# EasyEDA Pro project ProPrj_Gorb_热插拔无线鼠标V1.epro, schematic Schematic
Board Name: Gorb_V1; Create Date: 2025-12-01; Page Name: P1; Project Name: gorb; Schematic Name: Schematic; Update Date: 2025-12-15; Company: EasyEDA.com; Page Size: A4; Version: V1.0
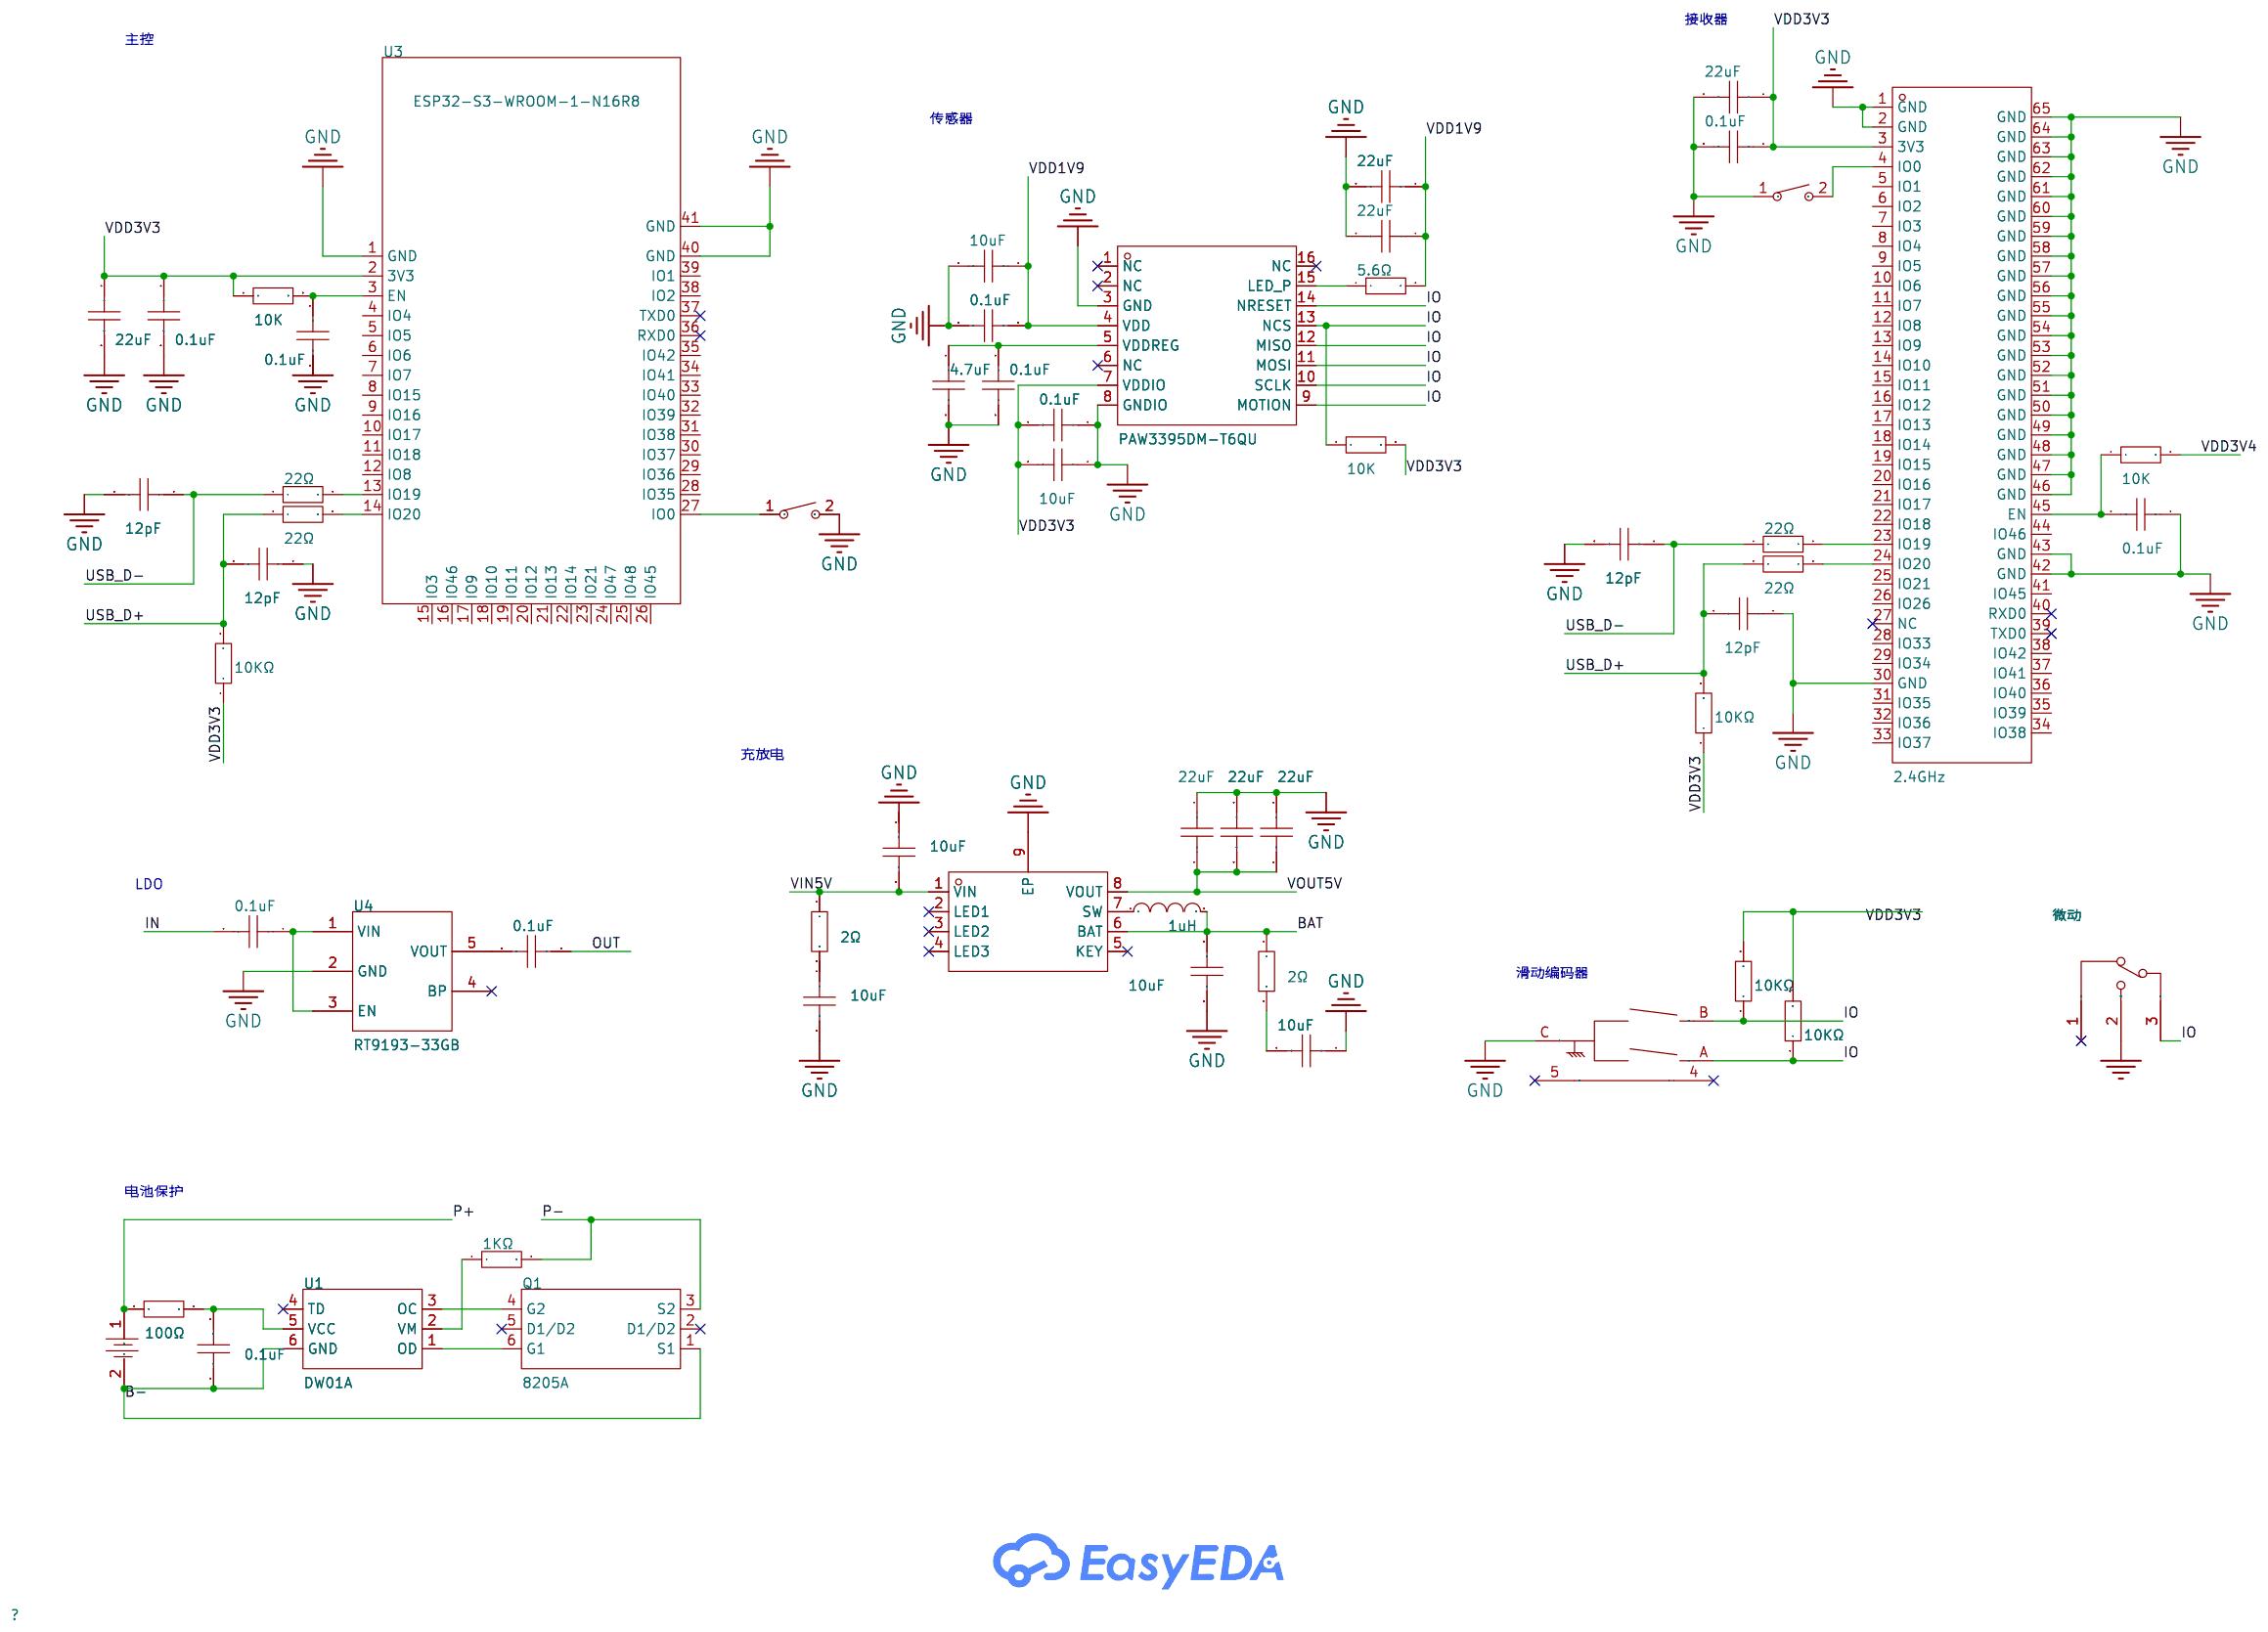
[diagram p0: schematic sheet]

## Parts
C1  0.1uF  [C0603]
C2  22uF  [C0603]
C3  0.1uF  [C0603]
C4  0.1uF  [C0603]
C5  12pF  [C0603]
C6  12pF  [C0603]
C7  0.1uF  [C0603]
C8  0.1uF  [C0603]
C9  10uF  [C0603]
C10  10uF  [C0603]
C11  10uF  [C0603]
C13  10uF  [C0603]
C14  22uF  [C0603]
C15  22uF  [C0603]
C16  22uF  [C0603]
C17  0.1uF  [C0603]
C19  10uF  [C0603]
C20  0.1uF  [C0603]
C21  4.7uF  [C0603]
C22  0.1uF  [C0603]
C23  10uF  [C0603]
C24  22uF  [C0603]
C25  22uF  [C0603]
C26  0.1uF  [C0603]
C27  22uF  [C0603]
C28  0.1uF  [C0603]
C29  12pF  [C0603]
C30  12pF  [C0603]
L1  1uH  [L0603]
Q1  8205A  [SOT-23-6_L2.9-W1.6-P0.95-LS2.8-BR]
R1  100Ω  [R0603]
R2  1KΩ  [R0603]
R3  10K  [R0603]
R4  22Ω  [R0603]
R5  22Ω  [R0603]
R6  10KΩ  [R0603]
R7  10KΩ  [R0603]
R8  2Ω  [R0603]
R9  2Ω  [R0603]
R10  5.6Ω  [R0603]
R11  10K  [R0603]
R12  10K  [R0603]
R13  22Ω  [R0603]
R14  22Ω  [R0603]
R?#1  10KΩ  [R0603]
SW1  CMI627301D07  [SW-TH_L6.2-W6.2-P5.00]
SW2  EC10E1220501  [SW-TH_EC10EXXXXXXX]
SW3  CMI627301D07  [SW-TH_L6.2-W6.2-P5.00]
U1  DW01A  [SOT-23-6_L2.9-W1.6-P0.95-LS2.8-BL]
U2  7号电池盒  [BAT-TH_L51.0-W24.0-P13.50-D0.8]
U3  ESP32-S3-WROOM-1-N16R8  [WIRELM-SMD_ESP32-S3-WROOM-1]
U4  RT9193-33GB  [SOT-23-5_L3.0-W1.7-P0.95-LS2.8-BL]
U5  2.4GHz  [WIFI-SMD_ESP32-MINI-1-N4]
U6  IP5306  [ESOP-8_L4.9-W3.9-P1.27-LS6.0-BL-EP]
U7  PAW3395DM-T6QU  [DIP-16_PAW3395DM-T6QU]
U8  10KΩ  [R0603]
微动  K9-1267T  [SW-TH_K9-1267T]

## Library data of the parts
C1-C11 C13-C17 C19-C30 = CAP_0603: Supplier Footprint: 0603
L1 = L_0603
Q1 = 8205A_C5370944: Number:2 N-Channel Drain to Source Voltage:20V Current - Continuous Drain(Id):6A RDS(on):25mΩ@2.5V,3A Pd - Power Dissipation:1.5W Gate Threshold Voltage (Vgs(th)):500mV Gate Charge(Qg):- Input Capacitance(Ciss):466pF@10V Reverse Transfer Capacitance (Crss; LCSC Part Name: 2个N沟道 耐压:20V 电流:6A; Supplier Part: C5370944; Manufacturer: TECH PUBLIC(台舟); Supplier Footprint: SOT-23-6; JLCPCB Part Class: Extended Part; Datasheet: https://item.szlcsc.com/datasheet/8205A/6217981.html; Supplier: LCSC; Number: 2 N-Channel; Drain to Source Voltage: 20V; Current - Continuous Drain(Id): 6A; RDS(on): 25mΩ@2.5V,3A; Pd - Power Dissipation: 1.5W; Gate Threshold Voltage (Vgs(th)): 500mV; Input Capacitance(Ciss): 466pF@10V; Reverse Transfer Capacitance (Crss@Vds): 58pF@10V; Operating Temperature: -55℃~+150℃
R1-R14 R?#1 U8 = Res_0603: Supplier Footprint: 0603
SW1 SW3 = CMI627301D07: Circuit:SPST Actuator Style:Round Button Operating Force:70gf Mounting Style:Direct Insert Switch Length:6.2mm Switch Width:6.2mm Switch Height:7.3mm Strike Gundam:Without Contact Current:50mA Voltage Rating (AC):- Voltage Rating (DC):12V Insulation Resis; LCSC Part Name: 6.2*6.2*7.3mm 直插 轻触开关; Supplier Part: C400268; Manufacturer: Kailh(凯华); Supplier Footprint: 插件; JLCPCB Part Class: Extended Part; Datasheet: https://atta.szlcsc.com/upload/public/pdf/source/20190626/C400268_F7CB2279ABA3B564A1652B4FF668916E.pdf; Supplier: LCSC; Circuit: SPST; Actuator Style: Round Button; Operating Force: 70gf; Mounting Style: Direct Insert; Switch Length: 6.2mm; Switch Width: 6.2mm; Switch Height: 7.3mm; Strike Gundam: Without; Contact Current: 50mA; Voltage Rating (DC): 12V; Insulation Resistance: 100MΩ; Actuator/Cap Color: Red; Pin Style: PCPin; Mechanical Life: 3 million times
SW2 = EC10E1220501: Supplier Part: C160889; Manufacturer: ALPSALPINE(阿尔卑斯阿尔派); Supplier Footprint: 插件; JLCPCB Part Class: Extended Part; Datasheet: https://atta.szlcsc.com/upload/public/pdf/source/20180227/C160889_15197014267581370273.pdf; Supplier: LCSC
U1 = DW01A_C351410: Supplier Part: C351410; Manufacturer: PUOLOP(迪浦); Supplier Footprint: SOT-23-6L; JLCPCB Part Class: Extended Part; Datasheet: https://atta.szlcsc.com/upload/public/pdf/source/20190109/C351410_3E9B9491D1909DF24C48D1B9CD871392.pdf; Supplier: LCSC
U2 = 7号电池盒: Supplier Part: C9900015507; Supplier Footprint: 引脚间距：13.5mm ,直插，2pin; JLCPCB Part Class: Extended Part; Supplier: LCSC
U3 = ESP32-S3-WROOM-1-N16R8: LCSC Part Name: 通用型Wi-Fi+低功耗蓝牙MCU模组; Supplier Part: C2913202; Manufacturer: ESPRESSIF(乐鑫); Supplier Footprint: SMD,25.5x18mm; JLCPCB Part Class: Extended Part; Datasheet: https://item.szlcsc.com/datasheet/ESP32-S3-WROOM-1-N16R8/3198300.html; Supplier: LCSC
U4 = RT9193-33GB: Output Type:Fixed Voltage - Supply:5.5V Output Voltage:3.3V Output Voltage:3.3V Output Current:300mA Power Supply Rejection Ratio (PSRR):-50dB@(10kHz) Voltage Dropout:220mV@(300mA) standby current:90uA Noise:100uVrms Features:Over Current Protection；Enabl; LCSC Part Name: 输入5.5V 输出3.3V 300mA; Supplier Part: C15651; Manufacturer: RICHTEK(立锜); Supplier Footprint: SOT-23-5; JLCPCB Part Class: Extended Part; Datasheet: https://item.szlcsc.com/datasheet/RT9193-33GB/16332.html; Supplier: LCSC; Output Type: Fixed; Voltage - Supply: 5.5V; Output Voltage: 3.3V; Output Current: 300mA; Power Supply Rejection Ratio (PSRR): -50dB@(10kHz); Voltage Dropout: 220mV@(300mA); standby current: 90uA; Noise: 100uVrms; Features: Over Current Protection；Enable；Over Temperature Protection; Operating Temperature: -40℃~+125℃@(Tj); Output Configuration: Positive; Number of Outputs: 1
U5 = ESP32-S2-MINI-1-N4: Core Processor:ESP32-S2FH4 chip Support Interface:I2C；GPIO；SPI；PWM；ADC；UART；USB；I2S Frequency:2.4GHz Output Power:19.5dBm Output Power:19.5dBm; LCSC Part Name: ESP32-S2-MINI-1-N4 停产; Supplier Part: C2847294; Manufacturer: ESPRESSIF(乐鑫); Supplier Footprint: SMD-65P; JLCPCB Part Class: Extended Part; Datasheet: https://atta.szlcsc.com/upload/public/pdf/source/20241030/68691157046C7706EC66C3038C2D4369.pdf; Supplier: LCSC; Core Processor: ESP32-S2FH4 chip; Support Interface: I2C；GPIO；SPI；PWM；ADC；UART；USB；I2S; Output Power: 19.5dBm
U6 = IP5306: The Chip Type:Charging IC；Protection IC Voltage - Supply:4.65V~5.5V Voltage - Supply:4.65V~5.5V Charge Current - Max:2.1A Charging Saturation Voltage:4.2V End-Off Voltage:3V Type of Battery:Lithium Battery Number of Cells:1 Number of Cells:1 Operating Tem; LCSC Part Name: 集成2.1A充电器和2.1A放电器的全集成移动电源系统级芯片; Supplier Part: C181692; Manufacturer: INJOINIC(英集芯); Supplier Footprint: ESOP-8; JLCPCB Part Class: Extended Part; Datasheet: https://item.szlcsc.com/datasheet/IP5306/193089.html; Supplier: LCSC; The Chip Type: Charging IC；Protection IC; Voltage - Supply: 4.65V~5.5V; Charge Current - Max: 2.1A; Charging Saturation Voltage: 4.2V; End-Off Voltage: 3V; Type of Battery: Lithium Battery; Number of Cells: 1; Operating Temperature: 0℃~+70℃; Supply Current (Iq): 100uA; Interface: I2C
U7 = PAW3395DM-T6QU: Supplier Part: C9900026543; Supplier Footprint: 16-PDIP; JLCPCB Part Class: Extended Part; Supplier: LCSC
微动 = K9-1267T: Circuit:SPDT Length:12.7mm Width:5.7mm Switch Height:7.5mm Current Rating (DC):100mA Voltage Rating (DC):30V Current Rating (AC):- Voltage Rating (AC):- Life:3,000,000 Cycles Operating Temperature:-25℃~+85℃ Operating Temperature:-25℃~+85℃; LCSC Part Name: 12.7*5.7*7.5mm 插件微动开关; Supplier Part: C107266; Manufacturer: 韩国韩荣; Supplier Footprint: 插件,12.7x5.7mm; JLCPCB Part Class: Extended Part; Datasheet: https://item.szlcsc.com/datasheet/K9-1267T/108484.html; Supplier: LCSC; Circuit: SPDT; Length: 12.7mm; Width: 5.7mm; Switch Height: 7.5mm; Current Rating (DC): 100mA; Voltage Rating (DC): 30V; Life: 3,000,000 Cycles; Operating Temperature: -25℃~+85℃

## Nets
GND: C2.2 C3.2 C4.2 C5.1 C6.2 C9.2 C10.1 C11.1 C13.2 C14.1 C15.1 C16.1 C17.2 C19.2 C20.2 C21.2 C22.1 C23.1 C24.2 C25.2 C26.2 C27.2 C28.1 C29.1 C30.2 SW1.2 SW2.C SW3.1 U3.1(GND) U3.40(GND) U3.41(GND) U4.2(GND) U5.1(GND) U5.2(GND) U5.30(GND) U5.42(GND) U5.43(GND) U5.46(GND) U5.47(GND) U5.48(GND) U5.49(GND) U5.50(GND) U5.51(GND) U5.52(GND) U5.53(GND) U5.54(GND) U5.55(GND) U5.56(GND) U5.57(GND) U5.58(GND) U5.59(GND) U5.60(GND) U5.61(GND) U5.62(GND) U5.63(GND) U5.64(GND) U5.65(GND) U6.9(EP) U7.3(GND) U7.8(GNDIO) 微动.2(ON)
VDD1V9: C17.1 C19.1 C24.1 C25.1 R10.2 U7.4(VDD)
VDD3V3: C2.1 C3.1 C22.2 C23.2 C26.1 C27.1 R3.1 R6.2 R7.2 R11.2 R?#1.1 U3.2(3V3) U5.3(3V3) U7.7(VDDIO) U8.1
VDD3V4: R12.2
VIN5V: C11.2 R8.1 U6.1(VIN)
B-: C1.1 Q1.1(S1) U1.6(GND) U2.2
BAT: C13.1 L1.2 R9.1 U6.6(BAT)
IN: C7.2
IO: R6.1 R7.1 R11.1 SW2.A SW2.B U7.9(MOTION) U7.10(SCLK) U7.11(MOSI) U7.12(MISO) U7.13(NCS) U7.14(NRESET) 微动.3(NC)
OUT: C8.1
P+: R1.1 U2.1
P-: Q1.3(S2) R2.2
USB_D+: C5.2 C29.2 R5.1 R14.1 R?#1.2 U8.2
USB_D-: C6.1 C30.1 R4.1 R13.1
VOUT5V: C14.2 C15.2 C16.2 U6.8(VOUT)
Net-(C1-2): C1.2 R1.2 U1.5(VCC)
Net-(C4-1): C4.1 R3.2 U3.3(EN)
Net-(C7-1): C7.1 U4.1(VIN) U4.3(EN)
Net-(C8-2): C8.2 U4.5(VOUT)
Net-(C9-1): C9.1 R8.2
Net-(C10-2): C10.2 R9.2
Net-(C20-1): C20.1 C21.1 U7.5(VDDREG)
Net-(C28-2): C28.2 R12.1 U5.45(EN)
Net-(L1-1): L1.1 U6.7(SW)
Net-(Q1-4): Q1.4(G2) U1.3(OC)
Net-(Q1-6): Q1.6(G1) U1.1(OD)
Net-(R2-1): R2.1 U1.2(VM)
Net-(R4-2): R4.2 U3.13(IO19)
Net-(R5-2): R5.2 U3.14(IO20)
Net-(R10-1): R10.1 U7.15(LED_P)
Net-(R13-2): R13.2 U5.23(IO19)
Net-(R14-2): R14.2 U5.24(IO20)
Net-(SW1-1): SW1.1 U3.27(IO0)
Net-(SW3-2): SW3.2 U5.4(IO0)

Not connected (* = marked no-connect by the designer): Q1 2(D1/D2)* 5(D1/D2)*; SW2 4* 5*; U1 4(TD)*; U3 4(IO4) 5(IO5) 6(IO6) 7(IO7) 8(IO15) 9(IO16) 10(IO17) 11(IO18) 12(IO8) 15(IO3) 16(IO46) 17(IO9) 18(IO10) 19(IO11) 20(IO12) 21(IO13) 22(IO14) 23(IO21) 24(IO47) 25(IO48) 26(IO45) 28(IO35) 29(IO36) 30(IO37) 31(IO38) 32(IO39) 33(IO40) 34(IO41) 35(IO42) 36(RXD0)* 37(TXD0)* 38(IO2) 39(IO1); U4 4(BP)*; U5 5(IO1) 6(IO2) 7(IO3) 8(IO4) 9(IO5) 10(IO6) 11(IO7) 12(IO8) 13(IO9) 14(IO10) 15(IO11) 16(IO12) 17(IO13) 18(IO14) 19(IO15) 20(IO16) 21(IO17) 22(IO18) 25(IO21) 26(IO26) 27(NC)* 28(IO33) 29(IO34) 31(IO35) 32(IO36) 33(IO37) 34(IO38) 35(IO39) 36(IO40) 37(IO41) 38(IO42) 39(TXD0)* 40(RXD0)* 41(IO45) 44(IO46); U6 2(LED1)* 3(LED2)* 4(LED3)* 5(KEY)*; U7 1(NC)* 2(NC)* 6(NC)* 16(NC)*; 微动 1(C)*

## Notes on the sheet
- 接收器
- 主控
- 传感器
- 充放电
- LDO
- 滑动编码器
- 电池保护
